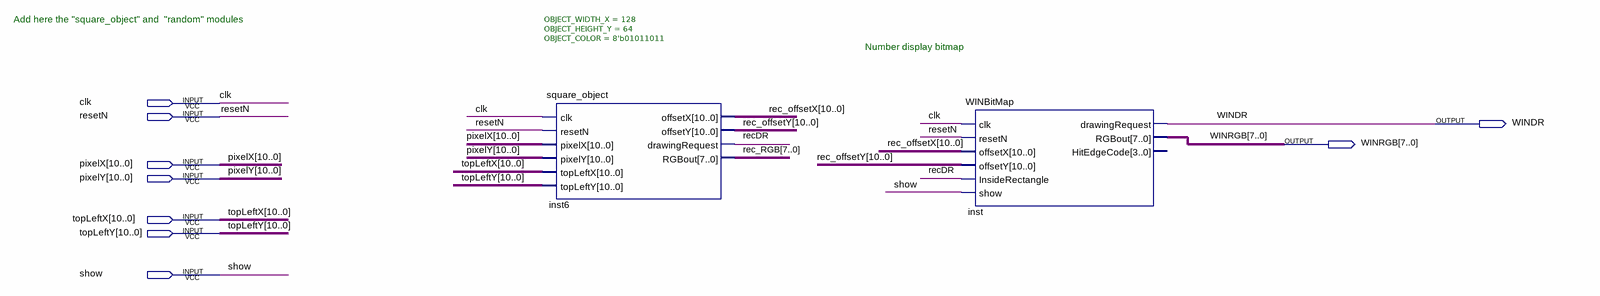
[diagram p0: schematic sheet]
// Quartus schematic WIN_DISPLAY.bdf as structural Verilog: 2 symbols, 9 pins
module WIN_DISPLAY (
  input  clk,
  input  resetN,
  input  [10:0] pixelX,
  input  [10:0] pixelY,
  input  [10:0] topLeftX,
  input  [10:0] topLeftY,
  input  show,
  output WINDR,
  output [7:0] WINRGB
);

  wire recDR;
  wire [7:0] rec_RGB;
  wire [10:0] rec_offsetX, rec_offsetY;

  square_object #(.OBJECT_WIDTH_X(128), .OBJECT_HEIGHT_Y(64), .OBJECT_COLOR(8'b01011011)) inst6 (
    .clk(clk), .resetN(resetN), .pixelX(pixelX), .pixelY(pixelY), .topLeftX(topLeftX), .topLeftY(topLeftY),
    .offsetX(rec_offsetX), .offsetY(rec_offsetY), .drawingRequest(recDR), .RGBout(rec_RGB));
  WINBitMap inst (
    .clk(clk), .resetN(resetN), .offsetX(rec_offsetX), .offsetY(rec_offsetY), .InsideRectangle(recDR),
    .show(show), .drawingRequest(WINDR), .RGBout(WINRGB));  // open: HitEdgeCode

  // Notes on the sheet:
  //   Add here the "square_object" and  "random" modules
  //   Number display bitmap
endmodule
